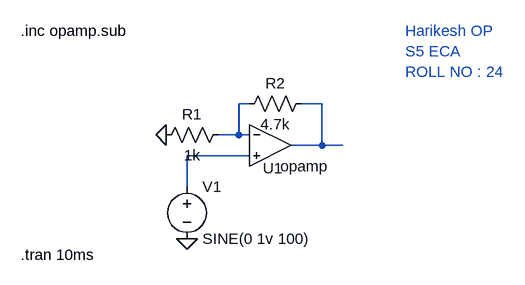
[diagram p0: schematic NON_INVERTING_AMP.asc]
NON_INVERTING_AMP.asc, the LTspice schematic file:
Version 4
SHEET 1 880 680
WIRE 208 112 192 112
WIRE 320 112 288 112
WIRE 192 160 192 112
WIRE 192 160 160 160
WIRE 208 160 192 160
WIRE 320 176 320 112
WIRE 320 176 272 176
WIRE 352 176 320 176
WIRE 208 192 112 192
WIRE 112 240 112 192
FLAG 112 320 0
FLAG 80 160 0
SYMBOL OpAmps\\opamp 240 112 R0
WINDOW 0 -11 99 Left 2
SYMATTR InstName U1
SYMBOL res 176 144 R90
WINDOW 0 0 56 VBottom 2
WINDOW 3 32 56 VTop 2
SYMATTR InstName R1
SYMATTR Value 1k
SYMBOL voltage 112 224 R0
WINDOW 123 0 0 Left 0
WINDOW 39 0 0 Left 0
SYMATTR InstName V1
SYMATTR Value SINE(0 1v 100)
SYMBOL res 304 96 R90
WINDOW 0 0 56 VBottom 2
WINDOW 3 32 56 VTop 2
SYMATTR InstName R2
SYMATTR Value 4.7k
TEXT -144 0 Left 2 !.inc opamp.sub
TEXT 448 0 Left 2 ;Harikesh OP\nS5 ECA \nROLL NO : 24
TEXT -144 344 Left 2 !.tran 10ms

The netlist it stands for:
* NON_INVERTING_AMP.asc
XU1 N001 N003 N002 opamp Aol=100K GBW=10Meg  ; pins invin noninvin out
R1 N001 0 1k
V1 N003 0 SINE(0 1v 100)
R2 N002 N001 4.7k
.inc opamp.sub
* Harikesh OP
* S5 ECA
* ROLL NO : 24
.tran 10ms
.backanno
.end